# EAGLE design esp8266kotak (EAGLE 9.2.2)
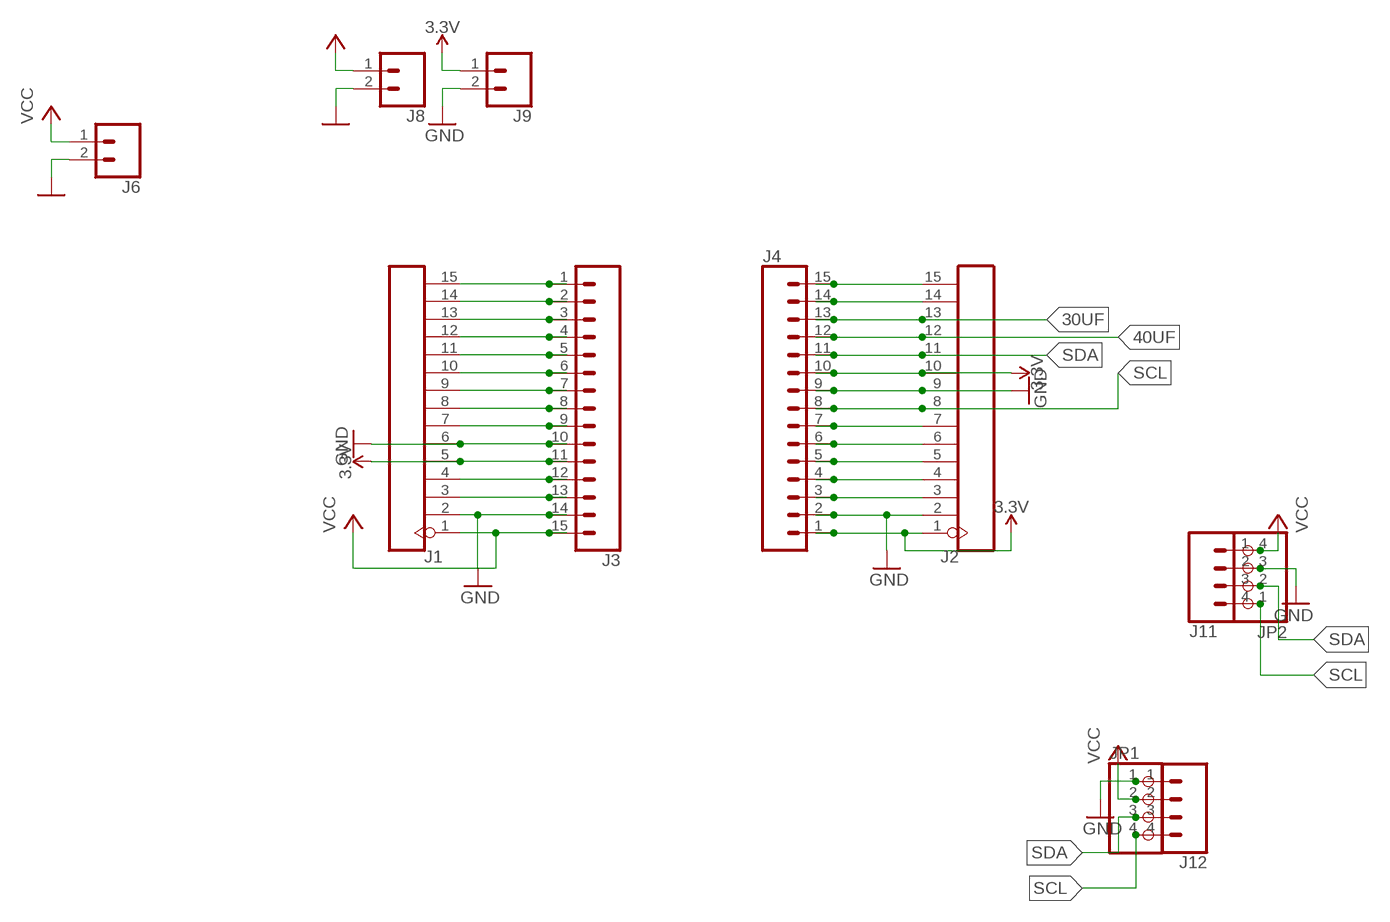
[diagram p0: schematic, sheet 1]

## Parts
J1  HEADER-15P2.54  [15P-2.54]
J2  HEADER-15P2.54  [15P-2.54]
J3  CONN_15  [1X15]
J4  CONN_15  [1X15]
J6  CONN_02  [1X02]
J8  CONN_02  [1X02]
J9  CONN_02  [1X02]
J11  CONN_04  [1X04]
J12  CONN_04  [1X04]
JP1  PINHD-1X4/90  [1X04/90]
JP2  PINHD-1X4/90  [1X04/90]

## Nets
3.3V: J1.5 J2.1 J2.10 J3.11 J4.1 J4.10 J9.1
30UF: J2.13 J4.13
40UF: J2.12 J4.12
GND: J1.2 J1.6 J2.2 J2.9 J3.10 J3.14 J4.2 J4.9 J6.2 J8.2 J9.2 J11.2 J12.1 JP1.1 JP2.3
N$3: J1.3 J3.13
N$4: J1.4 J3.12
N$7: J1.7 J3.9
N$8: J1.8 J3.8
N$9: J1.9 J3.7
N$10: J1.10 J3.6
N$11: J1.11 J3.5
N$12: J1.12 J3.4
N$13: J1.13 J3.3
N$14: J1.14 J3.2
N$15: J1.15 J3.1
N$18: J2.3 J4.3
N$19: J2.4 J4.4
N$20: J2.5 J4.5
N$21: J2.6 J4.6
N$22: J2.7 J4.7
N$29: J2.14 J4.14
N$30: J2.15 J4.15
SCL: J2.8 J4.8 J11.4 J12.4 JP1.4 JP2.1
SDA: J2.11 J4.11 J11.3 J12.3 JP1.3 JP2.2
VCC: J1.1 J3.15 J6.1 J8.1 J11.1 J12.2 JP1.2 JP2.4

## Library data of the parts
J1 J2 = for the universe:HEADER-15P: Header 15 Standard 15-pin 0.1" header. Use with straight break away headers (SKU : PRT-00116), right angle break away headers (PRT-00553), swiss pins (PRT-00743), machine pins (PRT-00117), and female headers (PRT-00115).
J3 J4 = for the universe:CONN_15: Multi connection point. Often used as Generic Header-pin footprint for 0.1 inch spaced/style header connections On any of the 0.1 inch spaced packages, you can populate with these: Break Away Headers - Straight <https://www.sparkfun.com/products/116> (PRT-00116) Break Away Male Headers - Right Angle <https://www.sparkfun.com/products/553> (PRT-00553) Female Headers <https://www.sparkfun.com/products/115> (PRT-00115) Break Away Headers - Machine Pin <https://www.sparkfun.com/products/117> (PRT-00117) Break Away Female Headers - Swiss Machine Pin <https://www.sparkfun.com/products/743> (PRT-00743) For SCREWTERMINALS and SPRING TERMINALS visit here: Screw Terimnals on SparkFun.com <https://www.sparkfun.com/search/results?term=Screw+Terminals> (5mm/3.5mm/2.54mm spacing) This device is also useful as a general connection point to wire up your design to another part of your project. Our various solder wires solder well into these plated through hole pads. Hook-Up Wire - Assortment (Stranded, 22 AWG) <https://www.sparkfun.com/products/11375> (PRT-11375) Hook-Up Wire - Assortment (Solid Core, 22 AWG) <https://www.sparkfun.com/products/11367> (PRT-11367) View the entire wire category on our website here <https://www.sparkfun.com/categories/141> Special notes: Molex polarized connector foot print use with SKU : PRT-08231 with associated crimp pins and housings. 1MM SMD Version SKU: PRT-10208 NOTES ON THE VARIANTS LOCK and LOCK_LONGPADS... This footprint was designed to help hold the alignment of a through-hole component (i.e. 6-pin header) while soldering it into place. You may notice that each hole has been shifted either up or down by 0.005 of an inch from it's more standard position (which is a perfectly straight line). This slight alteration caused the pins (the squares in the middle) to touch the edges of the holes. Because they are alternating, it causes a "brace" to hold the component in place. 0.005 has proven to be the perfect amount of "off-center" position when using our standard breakaway headers. Although looks a little odd when you look at the bare footprint, once you have a header in there, the alteration is very hard to notice. Also,if you push a header all the way into place, it is covered up entirely on the bottom side.
J6 J8 J9 = for the universe:CONN_02: Multi connection point. Often used as Generic Header-pin footprint for 0.1 inch spaced/style header connections On any of the 0.1 inch spaced packages, you can populate with these: Break Away Headers - Straight <https://www.sparkfun.com/products/116> (PRT-00116) Break Away Male Headers - Right Angle <https://www.sparkfun.com/products/553> (PRT-00553) Female Headers <https://www.sparkfun.com/products/115> (PRT-00115) Break Away Headers - Machine Pin <https://www.sparkfun.com/products/117> (PRT-00117) Break Away Female Headers - Swiss Machine Pin <https://www.sparkfun.com/products/743> (PRT-00743) For SCREWTERMINALS and SPRING TERMINALS visit here: Screw Terimnals on SparkFun.com <https://www.sparkfun.com/search/results?term=Screw+Terminals> (5mm/3.5mm/2.54mm spacing) This device is also useful as a general connection point to wire up your design to another part of your project. Our various solder wires solder well into these plated through hole pads. Hook-Up Wire - Assortment (Stranded, 22 AWG) <https://www.sparkfun.com/products/11375> (PRT-11375) Hook-Up Wire - Assortment (Solid Core, 22 AWG) <https://www.sparkfun.com/products/11367> (PRT-11367) View the entire wire category on our website here <https://www.sparkfun.com/categories/141> Special notes: Molex polarized connector foot print use with: PRT-08233 with associated crimp pins and housings. 2.54_SCREWTERM for use with PRT-10571. 3.5mm Screw Terminal footprints for PRT-08084 5mm Screw Terminal footprints for use with PRT-08432
J11 J12 = SparkFun-Connectors:CONN_04: Multi connection point. Often used as Generic Header-pin footprint for 0.1 inch spaced/style header connections On any of the 0.1 inch spaced packages, you can populate with these: Break Away Headers - Straight <https://www.sparkfun.com/products/116> (PRT-00116) Break Away Male Headers - Right Angle <https://www.sparkfun.com/products/553> (PRT-00553) Female Headers <https://www.sparkfun.com/products/115> (PRT-00115) Break Away Headers - Machine Pin <https://www.sparkfun.com/products/117> (PRT-00117) Break Away Female Headers - Swiss Machine Pin <https://www.sparkfun.com/products/743> (PRT-00743) For SCREWTERMINALS and SPRING TERMINALS visit here: Screw Terimnals on SparkFun.com <https://www.sparkfun.com/search/results?term=Screw+Terminals> (5mm/3.5mm/2.54mm spacing) This device is also useful as a general connection point to wire up your design to another part of your project. Our various solder wires solder well into these plated through hole pads. Hook-Up Wire - Assortment (Stranded, 22 AWG) <https://www.sparkfun.com/products/11375> (PRT-11375) Hook-Up Wire - Assortment (Solid Core, 22 AWG) <https://www.sparkfun.com/products/11367> (PRT-11367) View the entire wire category on our website here <https://www.sparkfun.com/categories/141> Special notes: Molex polarized connector foot print use with SKU : PRT-08231 with associated crimp pins and housings. 1MM SMD Version SKU: PRT-10208; PROD_ID: CONN-09696
JP1 JP2 = pinhead:PINHD-1X4: PIN HEADER

## Net classes
0 default: clearance 1.3 mm

## Board
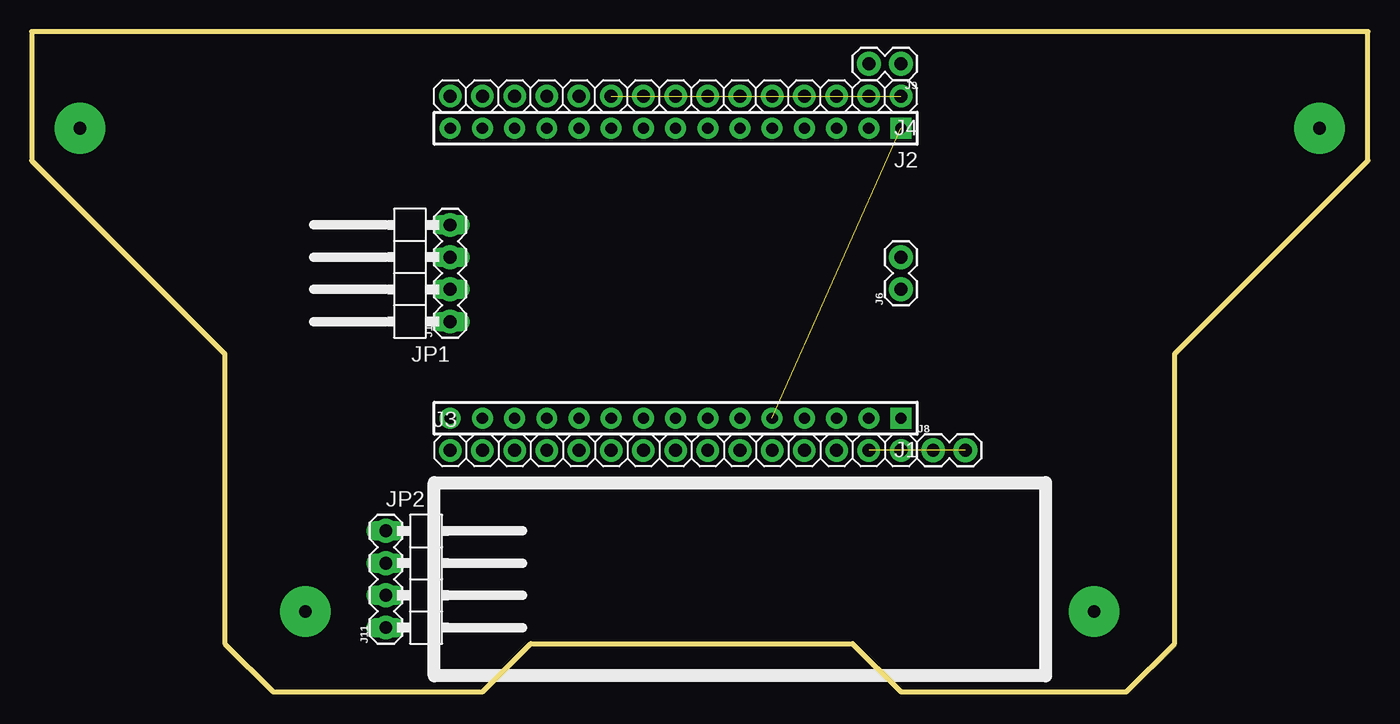
[diagram p1: board, top side]
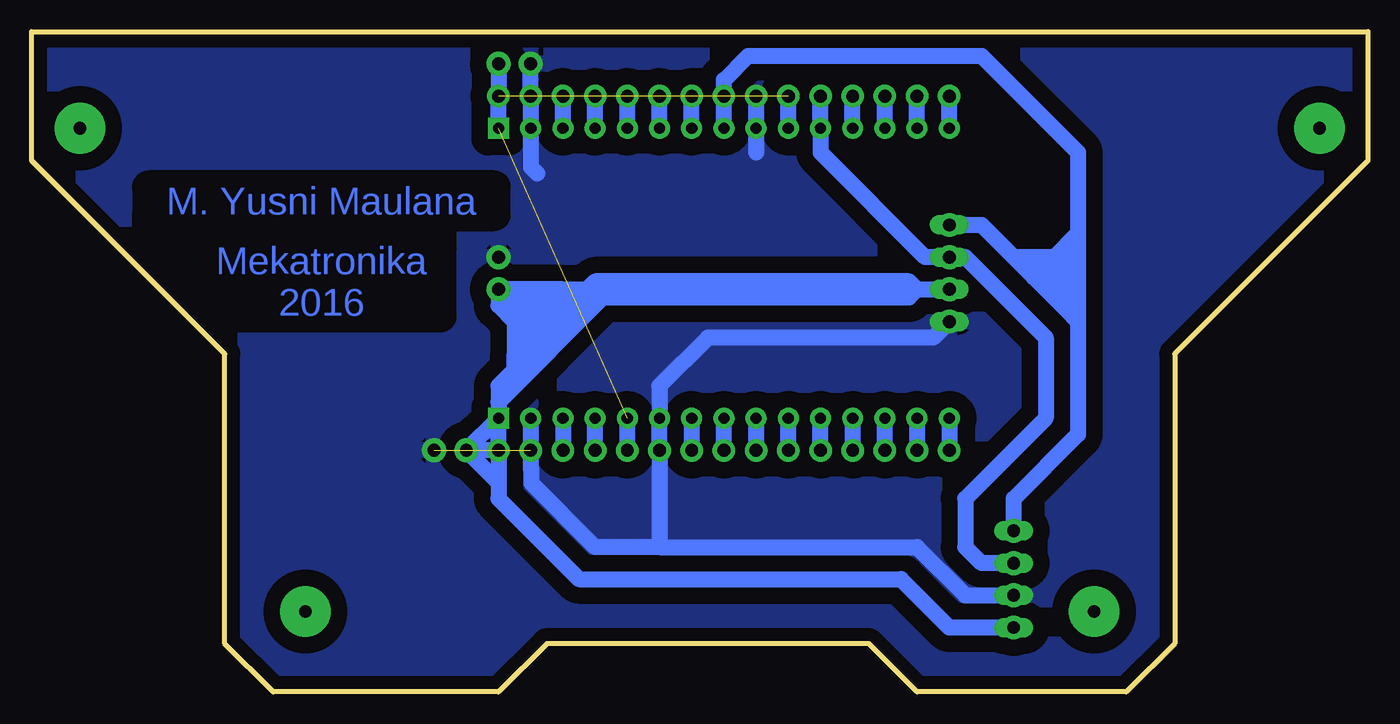
[diagram p2: board, bottom side, seen from below]

Size 105.41 x 52.07 mm. Coordinates in mm from the lower left corner, seen from the top.
Outline: 0,52.07 0,41.91 15.24,26.67 15.24,3.81 19.05,0 35.56,0 39.37,3.81 64.77,3.81 68.58,0 86.36,0 90.17,3.81 90.17,26.67 105.41,41.91 105.41,52.07 0,52.07
Copper layers (1*16): Top 0.035mm / dielectric 1.5mm / Bottom 0.035mm
Design rules "default": minimum track width 6mil, minimum drill 0.35mm, track to track 6mil, track to pad 6mil, pad to pad 6mil, via to via 6mil, smd to smd 6mil, copper to edge 40mil, drill to drill 6mil, minimum pad ring 10mil, minimum via ring 8mil, stop-mask expansion 4mil, vias tented up to drill 0mil, thermal gap 10mil

### Footprints (pad centres in the part's own frame; a part is rotated, then mirrored left to right if it is on the bottom)
15P-2.54 = drill 0.889 pad 1.651 square: 1 -17.78,0 | drill 0.889 pad 1.651: 2 -15.24,0; 3 -12.7,0; 4 -10.16,0; 5 -7.62,0; 6 -5.08,0; 7 -2.54,0; 8 0,0; 9 2.54,0; 10 5.08,0; 11 7.62,0; 12 10.16,0; 13 12.7,0; 14 15.24,0; 15 17.78,0
1X15 = drill 1.016 pad 1.778: 1 0,0; 2 2.54,0; 3 5.08,0; 4 7.62,0; 5 10.16,0; 6 12.7,0; 7 15.24,0; 8 17.78,0; 9 20.32,0; 10 22.86,0; 11 25.4,0; 12 27.94,0; 13 30.48,0; 14 33.02,0; 15 35.56,0
1X02 = drill 1.016 pad 1.88: 1 0,0; 2 2.54,0
1X04 = drill 1.016 pad 1.88: 1 0,0; 2 2.54,0; 3 5.08,0; 4 7.62,0
1X04/90 = drill 1.016 long: 1 -3.81,-3.81; 2 -1.27,-3.81; 3 1.27,-3.81; 4 3.81,-3.81

### Placement (x,y rotation side)
J1  50.8,21.59 180 top
J2  50.8,44.45 180 top
J3  33.02,19.05 0 top
J4  68.58,46.99 180 top
J6  68.58,31.75 90 top
J8  71.12,19.05 0 top
J9  68.58,49.53 180 top
J11  27.94,5.08 90 top
J12  33.02,29.21 90 top
JP1  29.21,33.02 90 top
JP2  31.75,8.89 270 top

### Tracks (layer width: path | path; a pad name or v marks a point on that pad's centre or on a via)
3.3V  (2 unrouted)
  Bottom 1.27: J2.1 J4.1 J9.1 | J2.10 J4.10 | J3.11 J1.5
30UF
  Bottom 1.27: J2.13 J4.13
40UF
  Bottom 1.27: J2.12 J4.12
GND  (1 unrouted)
  Bottom 1.27: 55.88,11.43 60.96,11.43 66.01,16.48 66.01,17.57 66.04,17.6 J3.14 J1.2 | 55.88,11.43 35.56,11.43 31.75,7.62 JP2.3 | 55.88,11.43 J3.10 J1.6 55.88,24.13 52.07,27.94 34.29,27.94 JP1.1 | 65.53,40.89 66.04,41.4 J2.2 J4.2 J9.2 | J4.9 J2.9 48.26,42.55
  pour Bottom: 0,52.07 0,19.05 19.05,0 86.36,0 105.41,19.05 105.41,52.07
N$3
  Bottom 1.27: J1.3 J3.13
N$4
  Bottom 1.27: J3.12 J1.4
N$7
  Bottom 1.27: J1.7 J3.9
N$8
  Bottom 1.27: J3.8 J1.8
N$9
  Bottom 1.27: J1.9 J3.7
N$10
  Bottom 1.27: J3.6 J1.10
N$11
  Bottom 1.27: J3.5 J1.11
N$12
  Bottom 1.27: J1.12 J3.4
N$13
  Bottom 1.27: J3.3 J1.13
N$14
  Bottom 1.27: J1.14 J3.2
N$15
  Bottom 1.27: J1.15 J3.1
N$18
  Bottom 1.27: J2.3 J4.3
N$19
  Bottom 1.27: J2.4 J4.4
N$20
  Bottom 1.27: J2.5 J4.5
N$21
  Bottom 1.27: J2.6 J4.6
N$22
  Bottom 1.27: J2.7 J4.7
N$29
  Bottom 1.27: J2.14 J4.14
N$30
  Bottom 1.27: J2.15 J4.15
N$36  (via drill 1 pad 4)
  other vias: 3.81,44.45
N$38  (via drill 1 pad 4)
  other vias: 101.6,44.45
N$39  (via drill 1 pad 4)
  other vias: 21.59,6.35
N$40  (via drill 1 pad 4)
  other vias: 83.82,6.35
SCL
  Bottom 1.27: J2.8 J4.8 50.8,48.26 48.89,50.17 30.48,50.17 22.86,42.55 22.86,36.2 | 22.86,36.2 22.86,29.21 | 22.86,29.21 22.86,20.32 27.94,15.24 JP2.1 | 31.75,36.83 JP1.4 30.48,36.83 27.94,34.29 | 27.94,34.29 26.99,33.34 | 26.99,33.34 26.35,32.7 | 26.35,32.7 23.81,30.16 | 23.81,30.16 22.86,29.21 | 26.35,32.7 24.77,34.29 | 24.77,34.29 22.86,36.2 | 24.77,34.29 27.94,34.29 | 26.99,33.34 26.67,33.66 24.13,33.66 23.5,34.29 | 23.5,34.29 23.5,34.93 | 23.5,34.29 23.5,31.12 | 23.5,31.12 23.5,30.48 23.81,30.16 | 23.5,31.12 25.4,33.02 24.13,33.02 24.13,32.39
SDA
  Bottom 1.27: JP2.2 30.48,10.16 31.75,11.43 31.75,15.24 25.4,21.59 25.4,27.94 31.75,34.29 JP1.3 34.92,34.29 43.18,42.55 J2.11 J4.11
VCC
  Bottom 1.27: 63.5,31.75 64.77,31.75 | 64.77,31.75 66.04,31.75 | 66.04,31.75 67.31,31.75 | 67.31,31.75 J6.1 68.58,30.48 | JP2.4 33.02,5.08 36.83,8.89 62.23,8.89 68.58,15.24 68.58,16.51 | 67.31,31.75 67.31,30.48 | 67.31,30.48 67.31,29.21 | 67.31,29.21 67.31,27.94 | 67.31,27.94 67.31,26.67 | 67.31,25.4 67.31,26.67 | 68.58,22.86 J1.1 | J3.15 J1.1 | 68.58,30.48 67.94,31.12 | 67.31,30.48 66.04,31.75 | 64.77,31.75 67.31,29.21 | 67.31,27.94 63.5,31.75 | 63.5,31.75 62.23,31.75 | 62.23,31.75 61.59,31.75 | 61.59,31.75 60.96,31.75 | 60.96,31.75 35.56,31.75 | 35.56,31.75 JP1.2 | 62.23,31.75 67.31,26.67 | 67.31,25.4 68.58,24.13 68.58,22.86 | 68.58,30.48 67.31,29.21 | 67.31,25.4 60.96,31.75 | 68.58,22.86 60.33,31.12 36.2,31.12 35.56,31.75 | 35.56,31.75 36.2,32.39 60.96,32.39 61.59,31.75 | J3.15 J8.1 | J3.15 68.58,16.51 | J8.1 68.58,16.51 | J8.1 J1.1

### Text on the board
Bottom: M. Yusni Maulana | Mekatronika / 2016